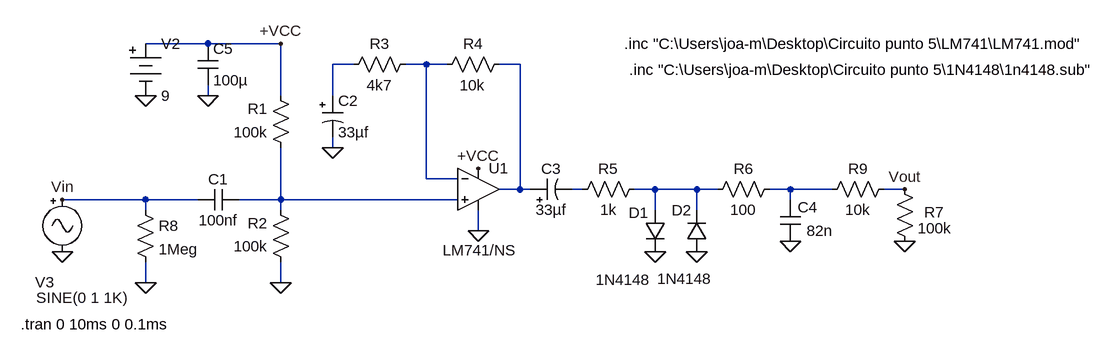
[diagram p0: schematic punto 5 senoide.asc]
punto 5 senoide.asc, the LTspice schematic file:
Version 4
SHEET 1 1228 680
WIRE -288 -80 -384 -80
WIRE -176 -80 -288 -80
WIRE -64 -48 -96 -48
WIRE 48 -48 16 -48
WIRE 80 -48 48 -48
WIRE 192 -48 160 -48
WIRE -288 0 -288 -16
WIRE -176 0 -176 -80
WIRE -96 0 -96 -48
WIRE -96 80 -96 64
WIRE 48 128 48 -48
WIRE 96 128 48 128
WIRE 192 144 192 -48
WIRE 192 144 160 144
WIRE 208 144 192 144
WIRE 288 144 272 144
WIRE 400 144 368 144
WIRE 464 144 400 144
WIRE 496 144 464 144
WIRE 608 144 576 144
WIRE 672 144 608 144
WIRE 784 144 752 144
WIRE -384 160 -512 160
WIRE -304 160 -384 160
WIRE -176 160 -176 80
WIRE -176 160 -240 160
WIRE 96 160 -176 160
WIRE 608 160 608 144
WIRE -384 176 -384 160
WIRE -176 176 -176 160
WIRE 400 176 400 144
WIRE 464 176 464 144
WIRE 128 208 128 176
WIRE -384 288 -384 256
WIRE -176 288 -176 256
FLAG -96 80 0
FLAG 400 240 0
FLAG 464 240 0
FLAG 608 224 0
FLAG 128 208 0
FLAG -176 288 0
FLAG 784 224 0
FLAG -288 0 0
FLAG -384 288 0
FLAG -512 240 0
FLAG -384 0 0
FLAG 784 144 Vout
FLAG -512 160 Vin
FLAG -176 -80 +VCC
FLAG 128 112 +VCC
SYMBOL Opamps\\opamp2 128 80 R0
WINDOW 3 -55 158 Left 2
SYMATTR Value LM741/NS
SYMATTR InstName U1
SYMBOL res -160 96 R180
WINDOW 0 36 76 Left 2
WINDOW 3 36 40 Left 2
SYMATTR InstName R1
SYMATTR Value 100k
SYMBOL res -160 272 R180
WINDOW 0 36 76 Left 2
WINDOW 3 36 40 Left 2
SYMATTR InstName R2
SYMATTR Value 100k
SYMBOL res -80 -32 R270
WINDOW 0 32 56 VTop 2
WINDOW 3 0 56 VBottom 2
SYMATTR InstName R3
SYMATTR Value 4k7
SYMBOL res 176 -64 R90
WINDOW 0 0 56 VBottom 2
WINDOW 3 32 57 VTop 2
SYMATTR InstName R4
SYMATTR Value 10k
SYMBOL res 384 128 R90
WINDOW 0 0 56 VBottom 2
WINDOW 3 32 56 VTop 2
SYMATTR InstName R5
SYMATTR Value 1k
SYMBOL cap -240 144 R90
WINDOW 0 0 32 VBottom 2
WINDOW 3 32 32 VTop 2
SYMATTR InstName C1
SYMATTR Value 100nf
SYMBOL cap 592 160 R0
WINDOW 0 27 12 Left 2
WINDOW 3 41 48 Left 2
SYMATTR InstName C4
SYMATTR Value 82n
SYMBOL diode 384 176 R0
WINDOW 0 -25 4 Left 2
WINDOW 3 19 106 Left 2
SYMATTR InstName D1
SYMATTR Value 1N4148
SYMBOL diode 480 240 R180
WINDOW 0 24 64 Left 2
WINDOW 3 87 -43 Left 2
SYMATTR InstName D2
SYMATTR Value 1N4148
SYMBOL res 768 128 R0
WINDOW 0 46 51 Left 2
SYMATTR InstName R7
SYMATTR Value 100k
SYMBOL res -400 160 R0
SYMATTR InstName R8
SYMATTR Value 1Meg
SYMBOL Misc\\battery -384 -96 R0
WINDOW 123 0 0 Left 2
WINDOW 39 0 0 Left 2
SYMATTR InstName V2
SYMATTR Value 9
SYMBOL Misc\\signal -512 144 R0
WINDOW 123 0 0 Left 2
WINDOW 39 0 0 Left 2
WINDOW 0 -42 143 Left 2
WINDOW 3 -40 167 Left 2
SYMATTR InstName V3
SYMBOL res 592 128 R90
WINDOW 0 0 56 VBottom 2
WINDOW 3 32 56 VTop 2
SYMATTR InstName R6
SYMATTR Value 100
SYMBOL res 768 128 R90
WINDOW 0 0 56 VBottom 2
WINDOW 3 32 56 VTop 2
SYMATTR InstName R9
SYMATTR Value 10k
SYMBOL polcap -112 0 R0
SYMATTR InstName C2
SYMATTR Value 33µf
SYMBOL polcap 208 160 R270
WINDOW 0 32 32 VTop 2
WINDOW 3 0 32 VBottom 2
SYMATTR InstName C3
SYMATTR Value 33µf
SYMBOL cap -304 -80 R0
SYMATTR InstName C5
SYMATTR Value 100µ
TEXT 352 -80 Left 2 !.inc "C:\\Users\\joa-m\\Desktop\\Circuito punto 5\\LM741\\LM741.mod"
TEXT 360 -40 Left 2 !.inc "C:\\Users\\joa-m\\Desktop\\Circuito punto 5\\1N4148\\1n4148.sub"
TEXT -576 352 Left 2 !.tran 0 10ms 0 0.1ms

The netlist it stands for:
* punto 5 senoide.asc
XU1 N007 N002 +VCC 0 N003 LM741/NS  ; pins In+ In- V+ V- OUT
R1 N007 +VCC 100k
R2 0 N007 100k
R3 N001 N002 4k7
R4 N003 N002 10k
R5 N005 N004 1k
C1 N007 Vin 100nf
C4 N006 0 82n
D1 N005 0 1N4148
D2 0 N005 1N4148
R7 Vout 0 100k
R8 Vin 0 1Meg
V2 +VCC 0 9
V3 Vin 0 SINE(0 1 1K)
R6 N006 N005 100
R9 Vout N006 10k
C2 N001 0 33µf
C3 N003 N004 33µf
C5 +VCC 0 100µ
.model D D
.lib standard.dio
.inc "C:\Users\joa-m\Desktop\Circuito punto 5\LM741\LM741.mod"
.inc "C:\Users\joa-m\Desktop\Circuito punto 5\1N4148\1n4148.sub"
.tran 0 10ms 0 0.1ms
.backanno
.end